# Altium project LTC6813_full_v1.PrjPCB
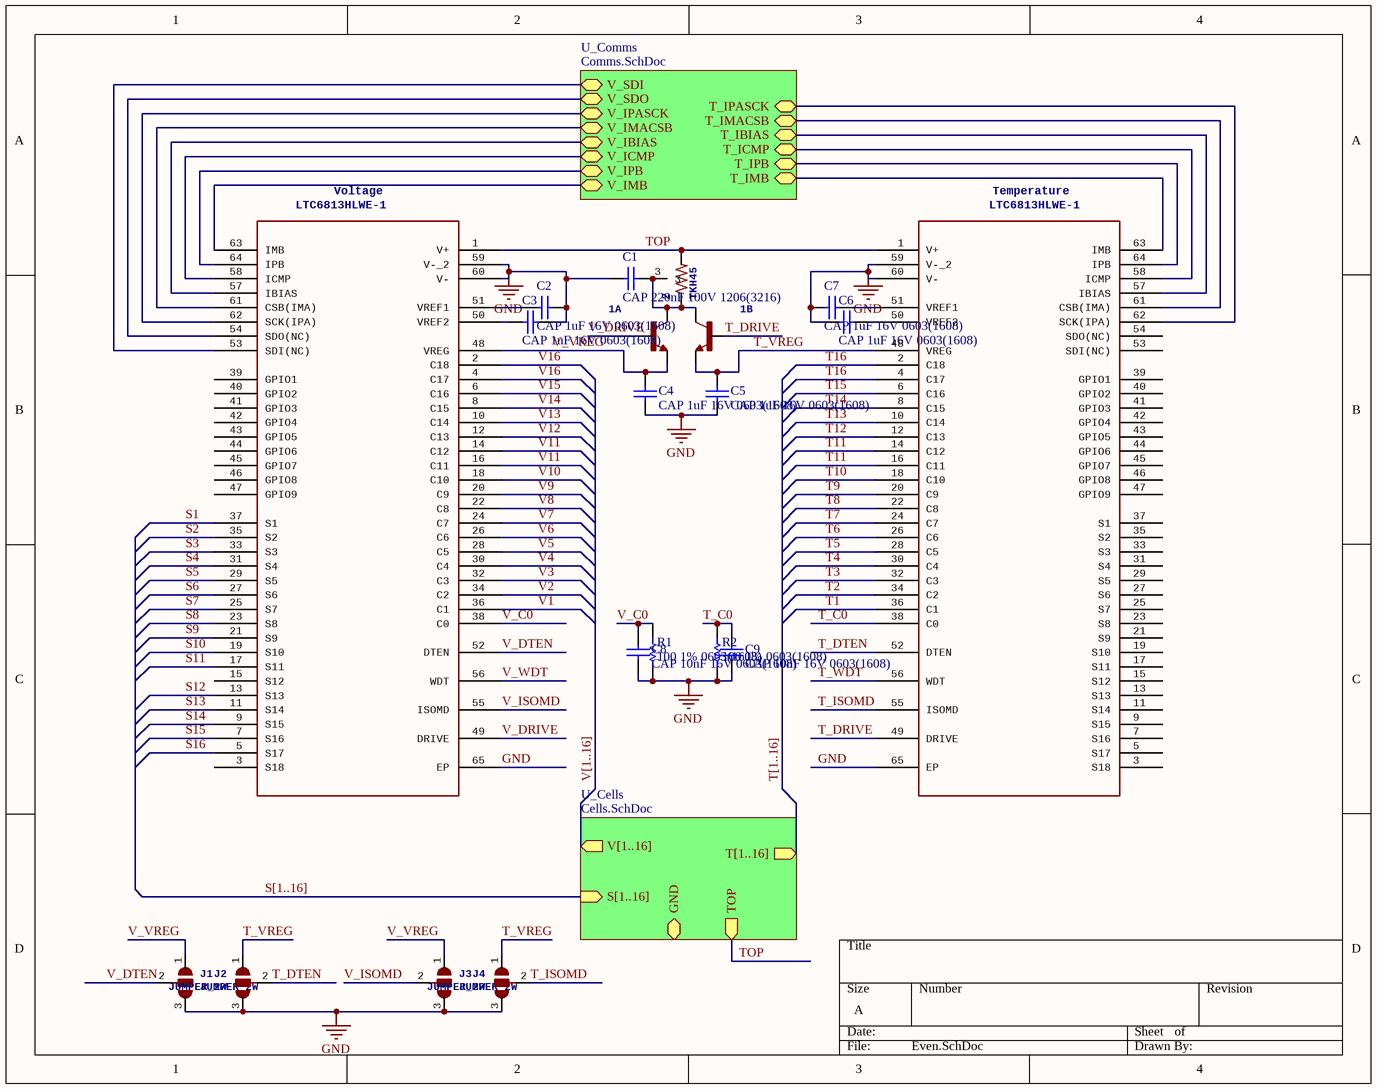
[diagram p0: Even.SchDoc]
4 sheets, 240 parts. Net scope: hierarchical (ports join the sheet entries above them; power ports are global).
Board files: Cell.PcbDoc, Even.PcbDoc
Sheets:
  Even.SchDoc
    U_Cells = Cells.SchDoc
      U_Cell1 = Cell.SchDoc
      U_Cell2 = Cell.SchDoc
      U_Cell3 = Cell.SchDoc
      U_Cell4 = Cell.SchDoc
      U_Cell5 = Cell.SchDoc
      U_Cell6 = Cell.SchDoc
      U_Cell7 = Cell.SchDoc
      U_Cell8 = Cell.SchDoc
      U_Cell9 = Cell.SchDoc
      U_Cell10 = Cell.SchDoc
      U_Cell11 = Cell.SchDoc
      U_Cell12 = Cell.SchDoc
      U_Cell13 = Cell.SchDoc
      U_Cell14 = Cell.SchDoc
      U_Cell15 = Cell.SchDoc
      U_Cell16 = Cell.SchDoc
    U_Comms = Comms.SchDoc

## Sheet Even.SchDoc
size A

### Parts
1  PHPT610030NK  [LFPAK56D]  (value not drawn)  (parts A,B of 2)
2  TKH45  [TO252-TKH-45]
C1  CAP 220nF 100V 1206(3216)  [CAPC1206(3216)190_L]
C2  CAP 1uF 16V 0603(1608)  [CAPC0603(1608)100_N]
C3  CAP 1uF 16V 0603(1608)  [CAPC0603(1608)100_N]
C4  CAP 1uF 16V 0603(1608)  [CAPC0603(1608)100_N]
C5  CAP 1uF 16V 0603(1608)  [CAPC0603(1608)100_N]
C6  CAP 1uF 16V 0603(1608)  [CAPC0603(1608)100_N]
C7  CAP 1uF 16V 0603(1608)  [CAPC0603(1608)100_N]
C8  CAP 10nF 16V 0603(1608)  [CAPC0603(1608)100_L]
C9  CAP 10nF 16V 0603(1608)  [CAPC0603(1608)100_L]
J1  JUMPER_2W  [SJ_2]
J2  JUMPER_2W  [SJ_2]
J3  JUMPER_2W  [SJ_2]
J4  JUMPER_2W  [SJ_2]
R1  100 1% 0603(1608)  [RESC0603(1608)_L]
R2  100 1% 0603(1608)  [RESC0603(1608)_L]
Temperature  LTC6813HLWE-1  [LQFP64_LWE_A]
Voltage  LTC6813HLWE-1  [LQFP64_LWE_A]

### Sub-sheets
U_Cells = Cells.SchDoc: GND (bidir), S[1..16] (in), T[1..16] (out), TOP (out), V[1..16] (out)
U_Comms = Comms.SchDoc: V_SDI (bidir), V_SDO (bidir), V_IMACSB (bidir), V_IPASCK (bidir), V_IPB (bidir), V_IMB (bidir), V_ICMP (bidir), V_IBIAS (bidir), T_IMACSB (bidir), T_IPASCK (bidir), T_IPB (bidir), T_IMB (bidir), T_IBIAS (bidir), T_ICMP (bidir)

### Nets
GND: C1.1 C2.2 C3.2 C4.1 C5.1 C6.1 C7.1 C8.2 C9.1 J1.3 J2.3 J3.3 J4.3 R1.1 R2.2 Temperature.59(V-_2) Temperature.60(V-) Temperature.65(EP) Voltage.59(V-_2) Voltage.60(V-) Voltage.65(EP)
S1: Voltage.37(S1)
S2: Voltage.35(S2)
S3: Voltage.33(S3)
S4: Voltage.31(S4)
S5: Voltage.29(S5)
S6: Voltage.27(S6)
S7: Voltage.25(S7)
S8: Voltage.23(S8)
S9: Voltage.21(S9)
S10: Voltage.19(S10)
S11: Voltage.17(S11)
S12: Voltage.13(S13)
S13: Voltage.11(S14)
S14: Voltage.9(S15)
S15: Voltage.7(S16)
S16: Voltage.5(S17)
T1: Temperature.36(C1)
T2: Temperature.34(C2)
T3: Temperature.32(C3)
T4: Temperature.30(C4)
T5: Temperature.28(C5)
T6: Temperature.26(C6)
T7: Temperature.24(C7)
T8: Temperature.22(C8)
T9: Temperature.20(C9)
T10: Temperature.18(C10)
T11: Temperature.14(C12) Temperature.16(C11)
T12: Temperature.12(C13)
T13: Temperature.10(C14)
T14: Temperature.8(C15)
T15: Temperature.6(C16)
T16: Temperature.2(C18) Temperature.4(C17)
T_C0: C9.2 R2.1 Temperature.38(C0)
T_DRIVE: 1.B2(B) Temperature.49(DRIVE)
T_DTEN: J2.2 Temperature.52(DTEN)
T_IBIAS: Temperature.57(IBIAS) ; sheet U_Comms/T_IBIAS
T_ICMP: Temperature.58(ICMP) ; sheet U_Comms/T_ICMP
T_IMACSB: Temperature.61(CSB(IMA)) ; sheet U_Comms/T_IMACSB
T_IMB: Temperature.63(IMB) ; sheet U_Comms/T_IMB
T_IPASCK: Temperature.62(SCK(IPA)) ; sheet U_Comms/T_IPASCK
T_IPB: Temperature.64(IPB) ; sheet U_Comms/T_IPB
T_ISOMD: J4.2 Temperature.55(ISOMD)
T_VREG: 1.E2(E) C5.2 J2.1 J4.1 Temperature.48(VREG)
T_WDT: Temperature.56(WDT)
TOP: 2.2 Temperature.1(V+) Voltage.1(V+) ; sheet U_Cells/TOP  [project net POS16]
V1: Voltage.36(C1)
V2: Voltage.34(C2)
V3: Voltage.32(C3)
V4: Voltage.30(C4)
V5: Voltage.28(C5)
V6: Voltage.26(C6)
V7: Voltage.24(C7)
V8: Voltage.22(C8)
V9: Voltage.20(C9)
V10: Voltage.18(C10)
V11: Voltage.14(C12) Voltage.16(C11)
V12: Voltage.12(C13)
V13: Voltage.10(C14)
V14: Voltage.8(C15)
V15: Voltage.6(C16)
V16: Voltage.2(C18) Voltage.4(C17)
V_C0: C8.1 R1.2 Voltage.38(C0)
V_DRIVE: 1.B1(B) Voltage.49(DRIVE)
V_DTEN: J1.2 Voltage.52(DTEN)
V_IBIAS: Voltage.57(IBIAS) ; sheet U_Comms/V_IBIAS
V_ICMP: Voltage.58(ICMP) ; sheet U_Comms/V_ICMP
V_IMACSB: Voltage.61(CSB(IMA)) ; sheet U_Comms/V_IMACSB
V_IMB: Voltage.63(IMB) ; sheet U_Comms/V_IMB
V_IPASCK: Voltage.62(SCK(IPA)) ; sheet U_Comms/V_IPASCK
V_IPB: Voltage.64(IPB) ; sheet U_Comms/V_IPB
V_ISOMD: J3.2 Voltage.55(ISOMD)
V_SDI: Voltage.53(SDI(NC)) ; sheet U_Comms/V_SDI
V_SDO: Voltage.54(SDO(NC)) ; sheet U_Comms/V_SDO
V_VREG: 1.E1(E) C4.2 J1.1 J3.1 Voltage.48(VREG)
V_WDT: Voltage.56(WDT)
Net1_C1: 1.C1(C) 1.C2(C) 2.1 2.3 C1.2
NetC2_1: C2.1 Voltage.51(VREF1)
NetC3_1: C3.1 Voltage.50(VREF2)
NetC6_2: C6.2 Temperature.50(VREF2)
NetC7_2: C7.2 Temperature.51(VREF1)

Not connected (* = marked no-connect by the designer): Temperature 3(S18) 5(S17) 7(S16) 9(S15) 11(S14) 13(S13) 15(S12) 17(S11) 19(S10) 21(S9) 23(S8) 25(S7) 27(S6) 29(S5) 31(S4) 33(S3) 35(S2) 37(S1) 39(GPIO1) 40(GPIO2) 41(GPIO3) 42(GPIO4) 43(GPIO5) 44(GPIO6) 45(GPIO7) 46(GPIO8) 47(GPIO9) 53(SDI(NC)) 54(SDO(NC)); Voltage 3(S18) 15(S12) 39(GPIO1) 40(GPIO2) 41(GPIO3) 42(GPIO4) 43(GPIO5) 44(GPIO6) 45(GPIO7) 46(GPIO8) 47(GPIO9)

### Buses and harness runs
bus S[1..16] = sheet U_Cells/S[1..16]
bus T[1..16] = sheet U_Cells/T[1..16]
bus V[1..16] = sheet U_Cells/V[1..16]

### Library data of the parts
1 = PHPT610030NK: GateName_1: G$1; SymbolName_1: NPN; GateName_2: G$2; SymbolName_2: NPN; LibraryName: IFE_Transistors; DeviceSetName: PHPT610030NK; Package: LFPAK56D
2 = TKH45: GateName_1: G$1; SymbolName_1: R-US; LibraryName: IFE_Resistors; DeviceSetName: TKH45; Package: TO252-TKH-45
C1 = CMP-1037-04407-1: CAP 220nF 100V ±10% 1206 (3216 Metric) Thickness 1.9mm SMD; Tolerance: Â±10%; Case-EIA: 1206; Case-Metric: 3216; Technology: SMT; Max Thickness: 1.9 mm; Rated Voltage: 100 V; Value: 220nF
C2-C7 = CMP-1035-02736-1: CAP 1uF 16V ±5% 0603 (1608 Metric) Thickness 1mm SMD; Case-Metric: 1608; Case-EIA: 0603; Tolerance: Â±5%; Technology: SMT; Max Thickness: 1 mm; Rated Voltage: 16 V; Value: 1uF
C8 C9 = CMP-1035-02309-1: CAP 10nF 16V ±1% 0603 (1608 Metric) Thickness 1mm SMD; Case-Metric: 1608; Tolerance: Â±1%; Case-EIA: 0603; Rated Voltage: 16 V; Technology: SMT; Max Thickness: 1 mm; Value: 10nF
J1-J4 = JUMPER_2W: GateName_1: G$1; SymbolName_1: SJ_2; LibraryName: IFE_Jumpers; DeviceSetName: JUMPER_2W; Package: SJ_2
R1 R2 = CMP-1012-00222-1: 2R94 0.1W 1% 0603 (1608 Metric)  SMD; Case-Metric: 1608; Case-EIA: 0603; Value: 2.94 Ohm; Power: 0.1 W; Technology: SMT; Tolerance: 1 %
Temperature Voltage = LTC6813HLWE-1: GateName_1: A; SymbolName_1: LTC6813XLWE-1; LibraryName: LTC6813_Official; DeviceSetName: LTC6813HLWE-1; Package: LQFP64_LWE_A

## Sheet Cells.SchDoc
size 152 x 63 mm
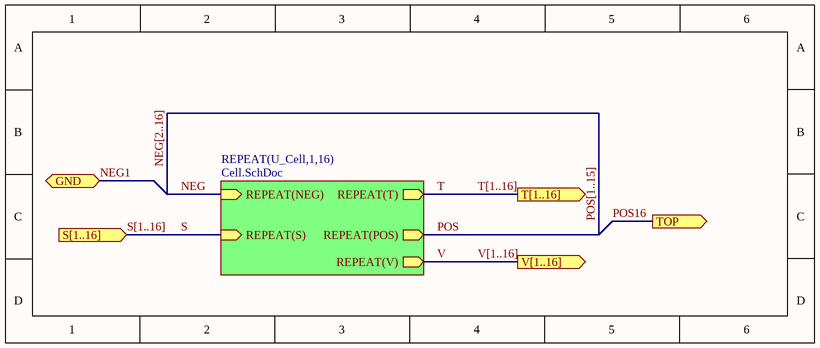
[diagram p1: Cells.SchDoc]

### Sub-sheets
REPEAT(U_Cell,1,16) = Cell.SchDoc: REPEAT(T) (out), REPEAT(NEG) (in), REPEAT(POS) (out), REPEAT(V) (out), REPEAT(S) (in)

### Ports
GND (bidir), S[1..16] (in), T[1..16] (out), TOP (out), V[1..16] (out)

### Nets
NEG: sheet REPEAT(U_Cell,1,16)/REPEAT(NEG)
POS: sheet REPEAT(U_Cell,1,16)/REPEAT(POS)
S: sheet REPEAT(U_Cell,1,16)/REPEAT(S)
T: sheet REPEAT(U_Cell,1,16)/REPEAT(T)  [also labelled T[1..16]]
V: sheet REPEAT(U_Cell,1,16)/REPEAT(V)  [also labelled V[1..16]]

### Buses and harness runs
bus NEG[2..16] = POS[1..15]
bus S[1..16] = port S[1..16]

## Sheet Cell.SchDoc
size 152 x 101 mm
Used 16 times, as channels U_Cells/U_Cell1, U_Cells/U_Cell2, U_Cells/U_Cell3, U_Cells/U_Cell4, U_Cells/U_Cell5, U_Cells/U_Cell6, U_Cells/U_Cell7, U_Cells/U_Cell8, U_Cells/U_Cell9, U_Cells/U_Cell10, U_Cells/U_Cell11, U_Cells/U_Cell12, U_Cells/U_Cell13, U_Cells/U_Cell14, U_Cells/U_Cell15, U_Cells/U_Cell16. Parts and nets are listed once, with the designators drawn on the sheet.
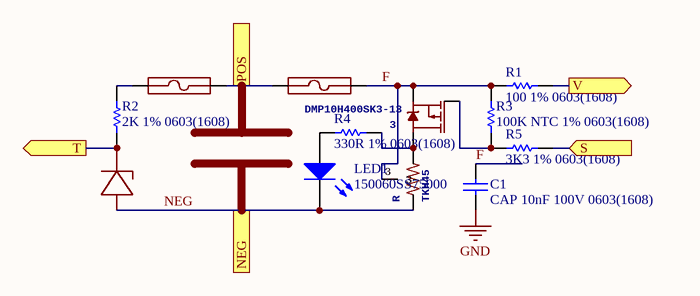
[diagram p2: Cell.SchDoc]

### Parts
3  DMP10H400SK3-13  [TO252]
C1  CAP 10nF 100V 0603(1608)  [CAPC0603(1608)100_N]
CELL+  LI6PT  [6PT]  (value not drawn)  (parts A,B of 2)
F1  0679L  [2410SMD]  (value not drawn)
F2  0679L  [2410SMD]  (value not drawn)
LED1  150060SS75000  [0603_A]
R  TKH45  [TO252-TKH-45]
R1  100 1% 0603(1608)  [RESC0603(1608)_L]
R2  2K 1% 0603(1608)  [RESC0603(1608)_L]
R3  100K NTC 1% 0603(1608)  [RESC0603(1608)_L]
R4  330R 1% 0603(1608)  [RESC0603(1608)_L]
R5  3K3 1% 0603(1608)  [RESC0603(1608)_L]

### Ports
NEG (in), POS (out), S (in), T (out), V (out)

### Nets
GND: C1.1
F: 3.3(S) C1.2 F2.P$2 R.3 R1.2 R3.2
NEG: CELL+.2(TEMP-) CELL+.CELL- LED1.1(K) R.1 ; port NEG
POS: CELL+.CELL+ F1.P$2 F2.P$1 ; port POS
S: R5.1 ; port S
T: CELL+.1(TEMP+) R2.1 ; port T
V: R1.1 ; port V
Net3_1: 3.1(G) R3.1 R5.2
Net3_2: 3.2(D) R.2 R4.1
NetF1_P$1: F1.P$1 R2.2
NetLED1_2: LED1.2(A) R4.2

### Channels
U_Cells/U_Cell1: designators end in _U_Cell1; ports NEG=NEG_U_Cell1 POS=NEG S=S1 T=T1 V=V1
U_Cells/U_Cell2: designators end in _U_Cell2; ports NEG=NEG POS=NEG S=S2 T=T2 V=V2
U_Cells/U_Cell3: designators end in _U_Cell3; ports NEG=NEG POS=NEG S=S3 T=T3 V=V3
U_Cells/U_Cell4: designators end in _U_Cell4; ports NEG=NEG POS=NEG S=S4 T=T4 V=V4
U_Cells/U_Cell5: designators end in _U_Cell5; ports NEG=NEG POS=NEG S=S5 T=T5 V=V5
U_Cells/U_Cell6: designators end in _U_Cell6; ports NEG=NEG POS=NEG S=S6 T=T6 V=V6
U_Cells/U_Cell7: designators end in _U_Cell7; ports NEG=NEG POS=NEG S=S7 T=T7 V=V7
U_Cells/U_Cell8: designators end in _U_Cell8; ports NEG=NEG POS=NEG S=S8 T=T8 V=V8
U_Cells/U_Cell9: designators end in _U_Cell9; ports NEG=NEG POS=NEG S=S9 T=T9 V=V9
U_Cells/U_Cell10: designators end in _U_Cell10; ports NEG=NEG POS=NEG S=S10 T=T10 V=V10
U_Cells/U_Cell11: designators end in _U_Cell11; ports NEG=NEG POS=NEG S=S11 T=T11 V=V11
U_Cells/U_Cell12: designators end in _U_Cell12; ports NEG=NEG POS=NEG S=S12 T=T12 V=V12
U_Cells/U_Cell13: designators end in _U_Cell13; ports NEG=NEG POS=NEG S=S13 T=T13 V=V13
U_Cells/U_Cell14: designators end in _U_Cell14; ports NEG=NEG POS=NEG S=S14 T=T14 V=V14
U_Cells/U_Cell15: designators end in _U_Cell15; ports NEG=NEG POS=NEG S=S15 T=T15 V=V15
U_Cells/U_Cell16: designators end in _U_Cell16; ports NEG=NEG POS=POS16 S=S16 T=T16 V=V16

### Library data of the parts
3 = DMP10H400SK3-13: GateName_1: G$1; SymbolName_1: LABELED-PMOS; LibraryName: IFE_Transistors; DeviceSetName: DMP10H400SK3-13; Package: TO252
C1 = CMP-1035-02324-1: CAP 10nF 100V ±5% 0603 (1608 Metric) Thickness 1mm SMD; Case-EIA: 0603; Tolerance: Â±5%; Case-Metric: 1608; Technology: SMT; Value: 10nF; Max Thickness: 1 mm; Rated Voltage: 100 V
CELL+ = LI6PT: GateName_1: G$1; SymbolName_1: ENERGUS_CELL; GateName_2: G$2; SymbolName_2: TEMP_JST_XH; LibraryName: IFE_Energus; DeviceSetName: LI6PT; Package: 6PT
F1 F2 = 0679L: GateName_1: G$1; SymbolName_1: FUSE; LibraryName: IFE_Fuses; DeviceSetName: 0679L; Package: 2410SMD
LED1 = CMP-1426-00004-1: SMD mono-color Chip LED, WL-SMCW, Super Red; Manufacturer: Wuerth Elektronik; PartNumber: 150060SS75000; ComponentLink2URL: http://katalog.we-online.com/led/datasheet/150060SS75000.pdf; ComponentLink2Description: Datasheet; PackageReference: 0603_A; ComponentLink1Description: Manufacturer URL; ComponentLink1URL: http://www.we-online.com; Color: Super Red
R = TKH45: GateName_1: G$1; SymbolName_1: R-US; LibraryName: IFE_Resistors; DeviceSetName: TKH45; Package: TO252-TKH-45
R1 = CMP-1012-00222-1: 100R 0.1W 1% 0603 (1608 Metric)  SMD; Case-Metric: 1608; Case-EIA: 0603; Value: 2.94 Ohm; Power: 0.1 W; Technology: SMT; Tolerance: 1 %
R2-R5 = CMP-1012-00222-1: as R1 on sheet Even; Power: 0.1 W; Technology: SMT; Tolerance: 1 %

## Sheet Comms.SchDoc
size A
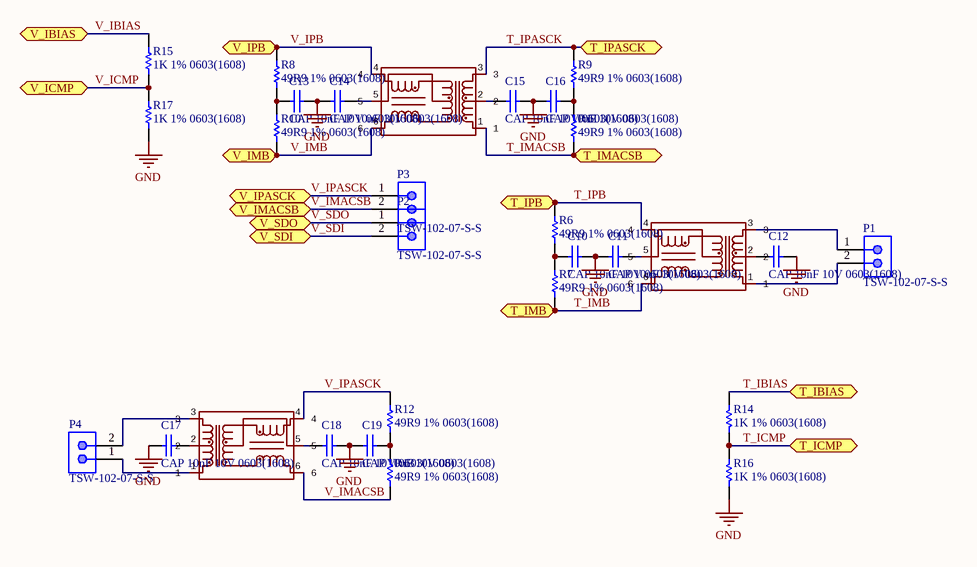
[diagram p3: Comms.SchDoc]

### Parts
4  HM2108NL  [HM2108NL]  (value not drawn)
5  HM2108NL  [HM2108NL]  (value not drawn)
6  HM2108NL  [HM2108NL]  (value not drawn)
C10  CAP 10nF 10V 0603(1608)  [CAPC0603(1608)100_M]
C11  CAP 10nF 10V 0603(1608)  [CAPC0603(1608)100_M]
C12  CAP 10nF 10V 0603(1608)  [CAPC0603(1608)100_M]
C13  CAP 10nF 10V 0603(1608)  [CAPC0603(1608)100_M]
C14  CAP 10nF 10V 0603(1608)  [CAPC0603(1608)100_M]
C15  CAP 10nF 10V 0603(1608)  [CAPC0603(1608)100_M]
C16  CAP 10nF 10V 0603(1608)  [CAPC0603(1608)100_M]
C17  CAP 10nF 10V 0603(1608)  [CAPC0603(1608)100_M]
C18  CAP 10nF 10V 0603(1608)  [CAPC0603(1608)100_M]
C19  CAP 10nF 10V 0603(1608)  [CAPC0603(1608)100_M]
P1  TSW-102-07-S-S  [SMTC-TSW-102-07-S-S]
P2  TSW-102-07-S-S  [SMTC-TSW-102-07-S-S]
P3  TSW-102-07-S-S  [SMTC-TSW-102-07-S-S]
P4  TSW-102-07-S-S  [SMTC-TSW-102-07-S-S]
R6  49R9 1% 0603(1608)  [RESC0603(1608)_N]
R7  49R9 1% 0603(1608)  [RESC0603(1608)_N]
R8  49R9 1% 0603(1608)  [RESC0603(1608)_N]
R9  49R9 1% 0603(1608)  [RESC0603(1608)_N]
R10  49R9 1% 0603(1608)  [RESC0603(1608)_N]
R11  49R9 1% 0603(1608)  [RESC0603(1608)_N]
R12  49R9 1% 0603(1608)  [RESC0603(1608)_N]
R13  49R9 1% 0603(1608)  [RESC0603(1608)_N]
R14  1K 1% 0603(1608)  [RESC0603(1608)_M]
R15  1K 1% 0603(1608)  [RESC0603(1608)_M]
R16  1K 1% 0603(1608)  [RESC0603(1608)_M]
R17  1K 1% 0603(1608)  [RESC0603(1608)_M]

### Ports
T_IBIAS (bidir), T_ICMP (bidir), T_IMACSB (bidir), T_IMB (bidir), T_IPASCK (bidir), T_IPB (bidir), V_IBIAS (bidir), V_ICMP (bidir), V_IMACSB (bidir), V_IMB (bidir), V_IPASCK (bidir), V_IPB (bidir), V_SDI (bidir), V_SDO (bidir)

### Nets
GND: C10.2 C11.1 C12.2 C13.2 C14.1 C15.2 C16.1 C17.1 C18.2 C19.1 R16.1 R17.1
T_IBIAS: R14.2 ; port T_IBIAS
T_ICMP: R14.1 R16.2 ; port T_ICMP
T_IMACSB: 5.1 R11.1 ; port T_IMACSB
T_IMB: 4.6 R7.1 ; port T_IMB
T_IPASCK: 5.3 R9.2 ; port T_IPASCK
T_IPB: 4.4 R6.2 ; port T_IPB
V_IBIAS: R15.2 ; port V_IBIAS
V_ICMP: R15.1 R17.2 ; port V_ICMP
V_IMACSB: 6.6 P3.2 R13.1 ; port V_IMACSB
V_IMB: 5.6 R10.1 ; port V_IMB
V_IPASCK: 6.4 P3.1 R12.2 ; port V_IPASCK
V_IPB: 5.4 R8.2 ; port V_IPB
V_SDI: P2.2 ; port V_SDI
V_SDO: P2.1 ; port V_SDO
Net4_1: 4.1 P1.2
Net4_2: 4.2 C12.1
Net4_3: 4.3 P1.1
Net4_5: 4.5 C11.2
Net5_2: 5.2 C15.1
Net5_5: 5.5 C14.2
Net6_1: 6.1 P4.1
Net6_2: 6.2 C17.2
Net6_3: 6.3 P4.2
Net6_5: 6.5 C18.1
NetC10_1: C10.1 R6.1 R7.2
NetC13_1: C13.1 R8.1 R10.2
NetC16_2: C16.2 R9.1 R11.2
NetC19_2: C19.2 R12.1 R13.2

### Library data of the parts
4-6 = HM2108NL: GateName_1: G$1; SymbolName_1: HM2108NL; LibraryName: Transformers and Chokes; DeviceSetName: HM2108NL; Package: HM2108NL
C10-C19 = CMP-1035-02304-1: CAP 10nF 10V ±2% 0603 (1608 Metric) Thickness 1mm SMD; Tolerance: Â±2%; Case-EIA: 0603; Case-Metric: 1608; Technology: SMT; Rated Voltage: 10 V; Value: 10nF; Max Thickness: 1 mm
P1 P3 = CMP-1681-00004-3: Male Header, Pitch 2.54 mm, 1 x 2 Position, Height 8.38 mm, Tail Length 2.54 mm, -55 to 125 degC, RoHS, Bulk; Rows: 1; Contact Plating: Gold; Length: 5.08 mm; PackageReference: TSW-102-07-S-S; Package Quantity: 1; Packaging: Bulk; Pins: 2; Max Operating Temperature: 125 degC; Mounting Technology: Through Hole; Mount: Through Hole; Min Operating Temperature: -55 degC; Height: 8.38 mm; PackageDescription: Male Header, Pitch 2.54 mm, 1 x 2 Position, Height 8.38 mm, Tail Length 2.54 mm; RoHSCompliant: true; Contact Material: Bronze; REACH SVHC: No SVHC; Lead Pitch: 0.1 inch; DatasheetVersion: 12/2015; Colour: Black; Contact Finish: Gold
P2 P4 = CMP-1681-00004-4: Male Header, Pitch 2.54 mm, 1 x 2 Position, Height 8.38 mm, Tail Length 2.54 mm, -55 to 125 degC, RoHS, Bulk; Manufacturer: Samtec; Rows: 1; ComponentLink1URL: http://www.samtec.com/; Contact Finish: Gold; Mounting Technology: Through Hole; PackageReference: TSW-102-07-S-S; RoHSCompliant: true; Pins: 2; Contact Material: Bronze; ComponentLink2Description: Datasheet; Max Operating Temperature: 125 degC; Min Operating Temperature: -55 degC; Height: 8.38 mm; Packaging: Bulk; ComponentLink1Description: Manufacturer URL; PackageDescription: Male Header, Pitch 2.54 mm, 1 x 2 Position, Height 8.38 mm, Tail Length 2.54 mm; Colour: Black; Contact Plating: Gold; Length: 5.08 mm; ComponentLink2URL: http://suddendocs.samtec.com/catalog_english/tsw_th.pdf; DatasheetVersion: 12/2015; Mount: Through Hole; Lead Pitch: 0.1 inch; REACH SVHC: No SVHC; Package Quantity: 1
R6-R13 = CMP-1012-00363-1: 49R9 0.1W 1% 0603 (1608 Metric)  SMD; Case-Metric: 1608; Case-EIA: 0603; Value: 49.90 Ohm; Power: 0.1 W; Tolerance: 1 %; Technology: SMT
R14-R17 = CMP-1012-00510-1: 1K 0.1W 1% 0603 (1608 Metric)  SMD; Case-Metric: 1608; Case-EIA: 0603; Value: 1000.00 Ohm; Technology: SMT; Tolerance: 1 %; Power: 0.1 W

## Nets that join several sheets
GND: Even (21 pins), U_Cells/U_Cell1 (C1_U_Cell1.1), U_Cells/U_Cell2 (C1_U_Cell2.1), U_Cells/U_Cell3 (C1_U_Cell3.1), U_Cells/U_Cell4 (C1_U_Cell4.1), U_Cells/U_Cell5 (C1_U_Cell5.1), U_Cells/U_Cell6 (C1_U_Cell6.1), U_Cells/U_Cell7 (C1_U_Cell7.1), U_Cells/U_Cell8 (C1_U_Cell8.1), U_Cells/U_Cell9 (C1_U_Cell9.1), U_Cells/U_Cell10 (C1_U_Cell10.1), U_Cells/U_Cell11 (C1_U_Cell11.1), U_Cells/U_Cell12 (C1_U_Cell12.1), U_Cells/U_Cell13 (C1_U_Cell13.1), U_Cells/U_Cell14 (C1_U_Cell14.1), U_Cells/U_Cell15 (C1_U_Cell15.1), U_Cells/U_Cell16 (C1_U_Cell16.1), Comms (12 pins)
NEG: U_Cells/U_Cell1 (CELL+_U_Cell1.CELL+ F1_U_Cell1.P$2 F2_U_Cell1.P$1), U_Cells/U_Cell2 (CELL+_U_Cell2.2 CELL+_U_Cell2.CELL- LED1_U_Cell2.1 R_U_Cell2.1)
NEG: U_Cells/U_Cell2 (CELL+_U_Cell2.CELL+ F1_U_Cell2.P$2 F2_U_Cell2.P$1), U_Cells/U_Cell3 (CELL+_U_Cell3.2 CELL+_U_Cell3.CELL- LED1_U_Cell3.1 R_U_Cell3.1)
NEG: U_Cells/U_Cell3 (CELL+_U_Cell3.CELL+ F1_U_Cell3.P$2 F2_U_Cell3.P$1), U_Cells/U_Cell4 (CELL+_U_Cell4.2 CELL+_U_Cell4.CELL- LED1_U_Cell4.1 R_U_Cell4.1)
NEG: U_Cells/U_Cell4 (CELL+_U_Cell4.CELL+ F1_U_Cell4.P$2 F2_U_Cell4.P$1), U_Cells/U_Cell5 (CELL+_U_Cell5.2 CELL+_U_Cell5.CELL- LED1_U_Cell5.1 R_U_Cell5.1)
NEG: U_Cells/U_Cell5 (CELL+_U_Cell5.CELL+ F1_U_Cell5.P$2 F2_U_Cell5.P$1), U_Cells/U_Cell6 (CELL+_U_Cell6.2 CELL+_U_Cell6.CELL- LED1_U_Cell6.1 R_U_Cell6.1)
NEG: U_Cells/U_Cell6 (CELL+_U_Cell6.CELL+ F1_U_Cell6.P$2 F2_U_Cell6.P$1), U_Cells/U_Cell7 (CELL+_U_Cell7.2 CELL+_U_Cell7.CELL- LED1_U_Cell7.1 R_U_Cell7.1)
NEG: U_Cells/U_Cell7 (CELL+_U_Cell7.CELL+ F1_U_Cell7.P$2 F2_U_Cell7.P$1), U_Cells/U_Cell8 (CELL+_U_Cell8.2 CELL+_U_Cell8.CELL- LED1_U_Cell8.1 R_U_Cell8.1)
NEG: U_Cells/U_Cell8 (CELL+_U_Cell8.CELL+ F1_U_Cell8.P$2 F2_U_Cell8.P$1), U_Cells/U_Cell9 (CELL+_U_Cell9.2 CELL+_U_Cell9.CELL- LED1_U_Cell9.1 R_U_Cell9.1)
NEG: U_Cells/U_Cell9 (CELL+_U_Cell9.CELL+ F1_U_Cell9.P$2 F2_U_Cell9.P$1), U_Cells/U_Cell10 (CELL+_U_Cell10.2 CELL+_U_Cell10.CELL- LED1_U_Cell10.1 R_U_Cell10.1)
NEG: U_Cells/U_Cell10 (CELL+_U_Cell10.CELL+ F1_U_Cell10.P$2 F2_U_Cell10.P$1), U_Cells/U_Cell11 (CELL+_U_Cell11.2 CELL+_U_Cell11.CELL- LED1_U_Cell11.1 R_U_Cell11.1)
NEG: U_Cells/U_Cell11 (CELL+_U_Cell11.CELL+ F1_U_Cell11.P$2 F2_U_Cell11.P$1), U_Cells/U_Cell12 (CELL+_U_Cell12.2 CELL+_U_Cell12.CELL- LED1_U_Cell12.1 R_U_Cell12.1)
NEG: U_Cells/U_Cell12 (CELL+_U_Cell12.CELL+ F1_U_Cell12.P$2 F2_U_Cell12.P$1), U_Cells/U_Cell13 (CELL+_U_Cell13.2 CELL+_U_Cell13.CELL- LED1_U_Cell13.1 R_U_Cell13.1)
NEG: U_Cells/U_Cell13 (CELL+_U_Cell13.CELL+ F1_U_Cell13.P$2 F2_U_Cell13.P$1), U_Cells/U_Cell14 (CELL+_U_Cell14.2 CELL+_U_Cell14.CELL- LED1_U_Cell14.1 R_U_Cell14.1)
NEG: U_Cells/U_Cell14 (CELL+_U_Cell14.CELL+ F1_U_Cell14.P$2 F2_U_Cell14.P$1), U_Cells/U_Cell15 (CELL+_U_Cell15.2 CELL+_U_Cell15.CELL- LED1_U_Cell15.1 R_U_Cell15.1)
NEG: U_Cells/U_Cell15 (CELL+_U_Cell15.CELL+ F1_U_Cell15.P$2 F2_U_Cell15.P$1), U_Cells/U_Cell16 (CELL+_U_Cell16.2 CELL+_U_Cell16.CELL- LED1_U_Cell16.1 R_U_Cell16.1)
POS16: Even (2.2 Temperature.1 Voltage.1), U_Cells/U_Cell16 (CELL+_U_Cell16.CELL+ F1_U_Cell16.P$2 F2_U_Cell16.P$1)
S1: Even (Voltage.37), U_Cells/U_Cell1 (R5_U_Cell1.1)
S2: Even (Voltage.35), U_Cells/U_Cell2 (R5_U_Cell2.1)
S3: Even (Voltage.33), U_Cells/U_Cell3 (R5_U_Cell3.1)
S4: Even (Voltage.31), U_Cells/U_Cell4 (R5_U_Cell4.1)
S5: Even (Voltage.29), U_Cells/U_Cell5 (R5_U_Cell5.1)
S6: Even (Voltage.27), U_Cells/U_Cell6 (R5_U_Cell6.1)
S7: Even (Voltage.25), U_Cells/U_Cell7 (R5_U_Cell7.1)
S8: Even (Voltage.23), U_Cells/U_Cell8 (R5_U_Cell8.1)
S9: Even (Voltage.21), U_Cells/U_Cell9 (R5_U_Cell9.1)
S10: Even (Voltage.19), U_Cells/U_Cell10 (R5_U_Cell10.1)
S11: Even (Voltage.17), U_Cells/U_Cell11 (R5_U_Cell11.1)
S12: Even (Voltage.13), U_Cells/U_Cell12 (R5_U_Cell12.1)
S13: Even (Voltage.11), U_Cells/U_Cell13 (R5_U_Cell13.1)
S14: Even (Voltage.9), U_Cells/U_Cell14 (R5_U_Cell14.1)
S15: Even (Voltage.7), U_Cells/U_Cell15 (R5_U_Cell15.1)
S16: Even (Voltage.5), U_Cells/U_Cell16 (R5_U_Cell16.1)
T_IBIAS: Even (Temperature.57), Comms (R14.2)
T_ICMP: Even (Temperature.58), Comms (R14.1 R16.2)
T_IMACSB: Even (Temperature.61), Comms (5.1 R11.1)
T_IMB: Even (Temperature.63), Comms (4.6 R7.1)
T_IPASCK: Even (Temperature.62), Comms (5.3 R9.2)
T_IPB: Even (Temperature.64), Comms (4.4 R6.2)
V_IBIAS: Even (Voltage.57), Comms (R15.2)
V_ICMP: Even (Voltage.58), Comms (R15.1 R17.2)
V_IMACSB: Even (Voltage.61), Comms (6.6 P3.2 R13.1)
V_IMB: Even (Voltage.63), Comms (5.6 R10.1)
V_IPASCK: Even (Voltage.62), Comms (6.4 P3.1 R12.2)
V_IPB: Even (Voltage.64), Comms (5.4 R8.2)
V_SDI: Even (Voltage.53), Comms (P2.2)
V_SDO: Even (Voltage.54), Comms (P2.1)